# Altium schematic sheet Projekat.SchDoc
size 297 x 209 mm
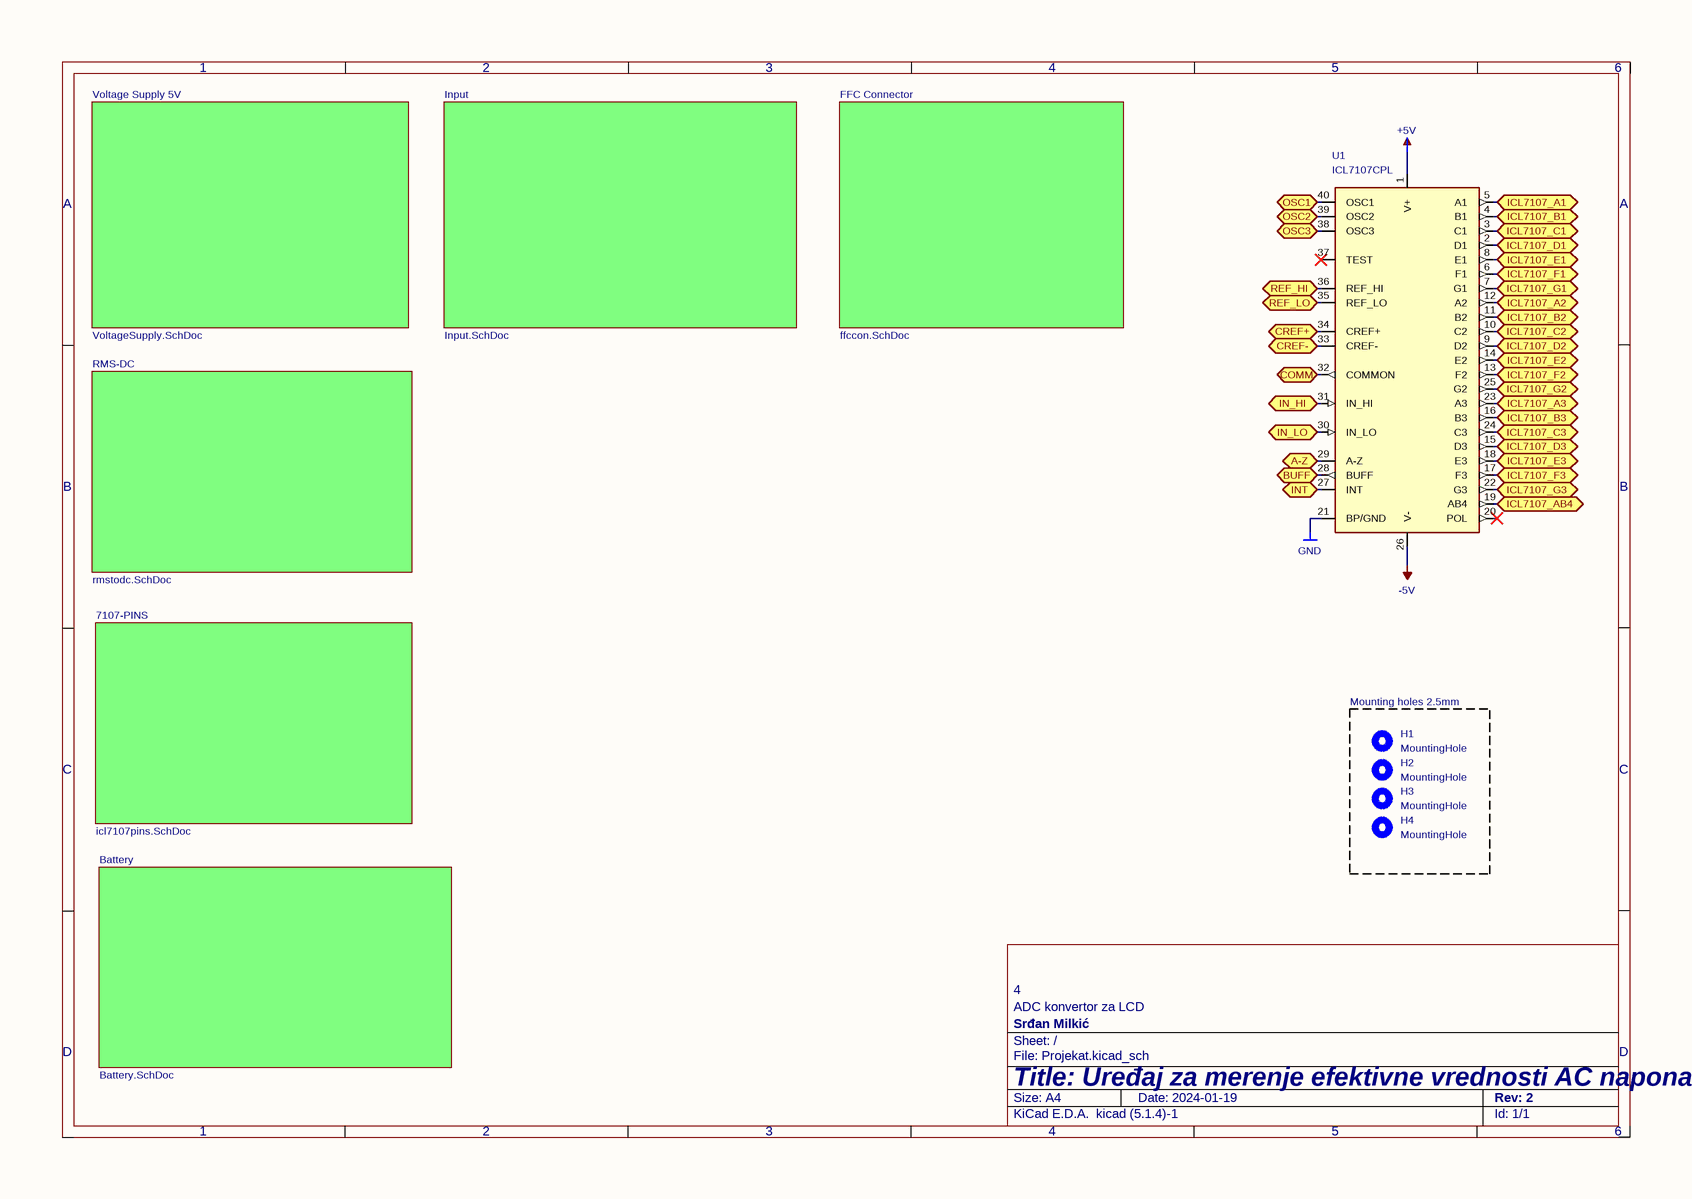
[diagram p0: Projekat.SchDoc]

## Parts
#PWR1  GND
#PWR02  +5V
#PWR03  -5V
H1  MountingHole  [MountingHole_2.5mm]
H2  MountingHole  [MountingHole_2.5mm]
H3  MountingHole  [MountingHole_2.5mm]
H4  MountingHole  [MountingHole_2.5mm]
U1  ICL7107CPL  [DIP-40_W15.24mm]

## Blocks framed on the sheet
Mounting holes 2.5mm /: H1-H4

## Sub-sheets
7107-PINS = icl7107pins.SchDoc: no entries
Battery = Battery.SchDoc: no entries
FFC Connector = ffccon.SchDoc: no entries
Input = Input.SchDoc: no entries
RMS-DC = rmstodc.SchDoc: no entries
Voltage Supply 5V = VoltageSupply.SchDoc: no entries

## Ports
A-Z (bidir), BUFF (bidir), COMM (bidir), CREF+ (bidir), CREF- (bidir), ICL7107_A1 (bidir), ICL7107_A2 (bidir), ICL7107_A3 (bidir), ICL7107_AB4 (bidir), ICL7107_B1 (bidir), ICL7107_B2 (bidir), ICL7107_B3 (bidir), ICL7107_C1 (bidir), ICL7107_C2 (bidir), ICL7107_C3 (bidir), ICL7107_D1 (bidir), ICL7107_D2 (bidir), ICL7107_D3 (bidir), ICL7107_E1 (bidir), ICL7107_E2 (bidir), ICL7107_E3 (bidir), ICL7107_F1 (bidir), ICL7107_F2 (bidir), ICL7107_F3 (bidir), ICL7107_G1 (bidir), ICL7107_G2 (bidir), ICL7107_G3 (bidir), IN_HI (bidir), IN_LO (bidir), INT (bidir), OSC1 (bidir), OSC2 (bidir), OSC3 (bidir), REF_HI (bidir), REF_LO (bidir)

## Nets
A-Z: U1.29(A-Z) ; port A-Z
BUFF: U1.28(BUFF) ; port BUFF
COMM: U1.32(COMMON) ; port COMM
CREF+: U1.34(CREF+) ; port CREF+
CREF-: U1.33(CREF-) ; port CREF-
ICL7107_A1: U1.5(A1) ; port ICL7107_A1
ICL7107_A2: U1.12(A2) ; port ICL7107_A2
ICL7107_A3: U1.23(A3) ; port ICL7107_A3
ICL7107_AB4: U1.19(AB4) ; port ICL7107_AB4
ICL7107_B1: U1.4(B1) ; port ICL7107_B1
ICL7107_B2: U1.11(B2) ; port ICL7107_B2
ICL7107_B3: U1.16(B3) ; port ICL7107_B3
ICL7107_C1: U1.3(C1) ; port ICL7107_C1
ICL7107_C2: U1.10(C2) ; port ICL7107_C2
ICL7107_C3: U1.24(C3) ; port ICL7107_C3
ICL7107_D1: U1.2(D1) ; port ICL7107_D1
ICL7107_D2: U1.9(D2) ; port ICL7107_D2
ICL7107_D3: U1.15(D3) ; port ICL7107_D3
ICL7107_E1: U1.8(E1) ; port ICL7107_E1
ICL7107_E2: U1.14(E2) ; port ICL7107_E2
ICL7107_E3: U1.18(E3) ; port ICL7107_E3
ICL7107_F1: U1.6(F1) ; port ICL7107_F1
ICL7107_F2: U1.13(F2) ; port ICL7107_F2
ICL7107_F3: U1.17(F3) ; port ICL7107_F3
ICL7107_G1: U1.7(G1) ; port ICL7107_G1
ICL7107_G2: U1.25(G2) ; port ICL7107_G2
ICL7107_G3: U1.22(G3) ; port ICL7107_G3
IN_HI: U1.31(IN_HI) ; port IN_HI
IN_LO: U1.30(IN_LO) ; port IN_LO
INT: U1.27(INT) ; port INT
OSC1: U1.40(OSC1) ; port OSC1
OSC2: U1.39(OSC2) ; port OSC2
OSC3: U1.38(OSC3) ; port OSC3
REF_HI: U1.36(REF_HI) ; port REF_HI
REF_LO: U1.35(REF_LO) ; port REF_LO
Net#PWR02_1: #PWR02.1(+5V) U1.1(V+)
Net#PWR03_1: #PWR03.1(-5V) U1.26(V-)

Not connected (* = marked no-connect by the designer): #PWR1 1(GND); U1 20(POL)* 21(BP/GND) 37(TEST)*

## Notes on the sheet
- 1
- 2
- 3
- 4
- 5
- 6
- A
- B
- C
- ADC konvertor za LCD
- D
- Title: Uređaj za merenje efektivne vrednosti AC napona
- File: Projekat.kicad_sch
- Sheet: /
- Srđan Milkić
- KiCad E.D.A.  kicad (5.1.4)-1
- Size: A4
- Date: 2024-01-19
- Rev: 2
- Id: 1/1

## Library data of the parts
#PWR1 = GND: Value: GND
#PWR02 = +5V: Value: +5V
#PWR03 = -5V: Value: -5V
H1-H4 = MountingHole: Value: MountingHole; Footprint: MountingHole:MountingHole_2.5mm
U1 = ICL7107CPL: Value: ICL7107CPL; Footprint: Package_DIP:DIP-40_W15.24mm